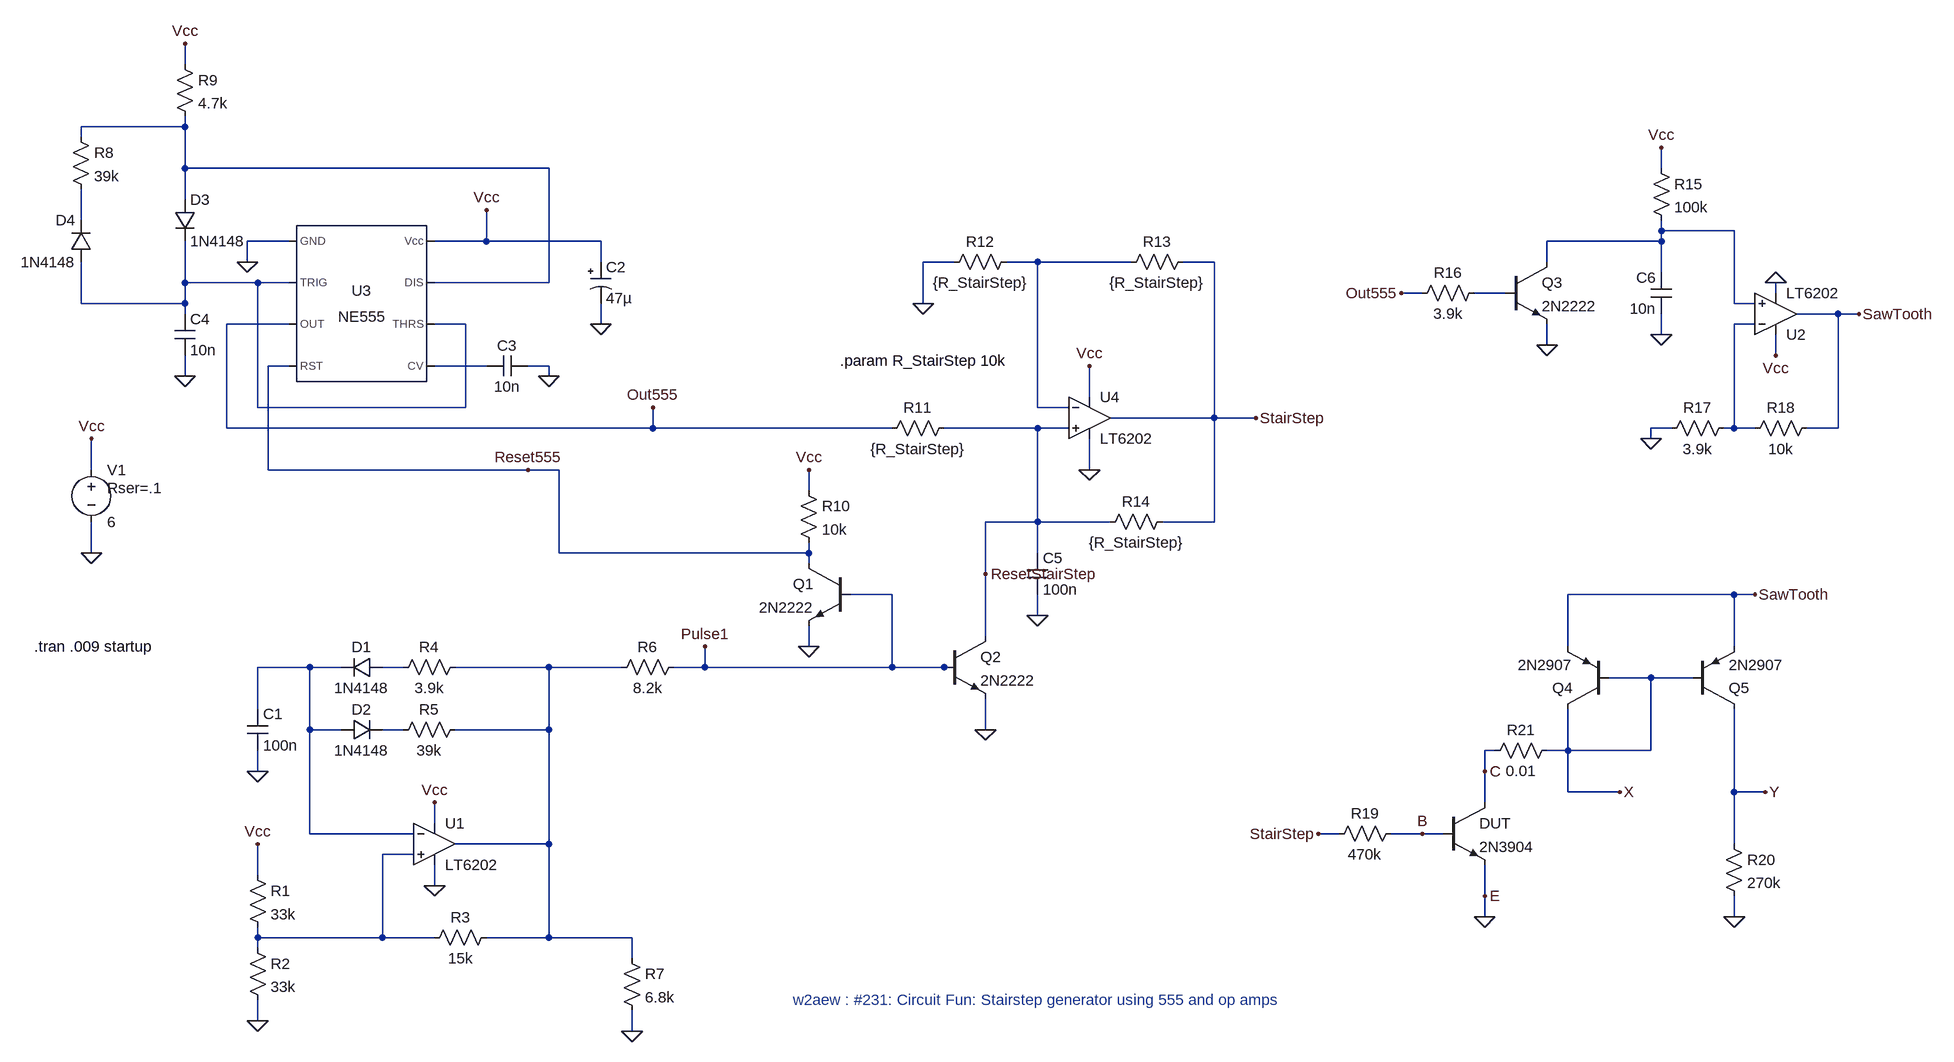
[diagram p0: schematic w2aew_CurveTracer1.asc]
w2aew_CurveTracer1.asc, the LTspice schematic file:
Version 4.1
SHEET 1 2508 1316
WIRE -1264 -848 -1264 -880
WIRE -1264 -752 -1264 -768
WIRE -1264 -752 -1424 -752
WIRE -1424 -736 -1424 -752
WIRE -1264 -688 -1264 -752
WIRE -704 -688 -1264 -688
WIRE 1008 -688 1008 -720
WIRE -1264 -640 -1264 -688
WIRE -1424 -608 -1424 -656
WIRE 1008 -592 1008 -608
WIRE 1120 -592 1008 -592
WIRE -1104 -576 -1168 -576
WIRE -800 -576 -800 -624
WIRE -800 -576 -880 -576
WIRE -624 -576 -800 -576
WIRE 1008 -576 1008 -592
WIRE 1008 -576 832 -576
WIRE -1168 -544 -1168 -576
WIRE -624 -544 -624 -576
WIRE -80 -544 -128 -544
WIRE 48 -544 0 -544
WIRE 192 -544 48 -544
WIRE 320 -544 272 -544
WIRE 832 -544 832 -576
WIRE 1008 -528 1008 -576
WIRE -1264 -512 -1264 -576
WIRE -1152 -512 -1264 -512
WIRE -1104 -512 -1152 -512
WIRE -704 -512 -704 -688
WIRE -704 -512 -880 -512
WIRE 640 -496 608 -496
WIRE 768 -496 720 -496
WIRE 1184 -496 1184 -512
WIRE -1424 -480 -1424 -544
WIRE -1264 -480 -1264 -512
WIRE -1264 -480 -1424 -480
WIRE -128 -480 -128 -544
WIRE 1120 -480 1120 -592
WIRE 1152 -480 1120 -480
WIRE -1264 -464 -1264 -480
WIRE 1280 -464 1216 -464
WIRE 1312 -464 1280 -464
WIRE -1104 -448 -1200 -448
WIRE -832 -448 -880 -448
WIRE -624 -448 -624 -480
WIRE 1152 -448 1120 -448
WIRE 1008 -432 1008 -464
WIRE 832 -416 832 -448
WIRE 1184 -400 1184 -432
WIRE -1104 -384 -1136 -384
WIRE -800 -384 -880 -384
WIRE -704 -384 -736 -384
WIRE -1264 -368 -1264 -400
WIRE -704 -368 -704 -384
WIRE 128 -336 128 -384
WIRE -1152 -320 -1152 -512
WIRE -832 -320 -832 -448
WIRE -832 -320 -1152 -320
WIRE 48 -320 48 -544
WIRE 96 -320 48 -320
WIRE 320 -304 320 -544
WIRE 320 -304 160 -304
WIRE 384 -304 320 -304
WIRE -1200 -288 -1200 -448
WIRE -544 -288 -544 -320
WIRE -544 -288 -1200 -288
WIRE -176 -288 -544 -288
WIRE 48 -288 -96 -288
WIRE 96 -288 48 -288
WIRE 1024 -288 992 -288
WIRE 1120 -288 1120 -448
WIRE 1120 -288 1104 -288
WIRE 1152 -288 1120 -288
WIRE 1280 -288 1280 -464
WIRE 1280 -288 1232 -288
WIRE 992 -272 992 -288
WIRE -1408 -224 -1408 -272
WIRE -1136 -224 -1136 -384
WIRE -736 -224 -1136 -224
WIRE -688 -224 -736 -224
WIRE 128 -224 128 -272
WIRE -304 -192 -304 -224
WIRE 48 -144 48 -288
WIRE 48 -144 -32 -144
WIRE 160 -144 48 -144
WIRE 320 -144 320 -304
WIRE 320 -144 240 -144
WIRE -1408 -96 -1408 -144
WIRE -688 -96 -688 -224
WIRE -304 -96 -304 -112
WIRE -304 -96 -688 -96
WIRE 48 -96 48 -144
WIRE -304 -80 -304 -96
WIRE -32 -64 -32 -144
WIRE -176 -32 -240 -32
WIRE 1120 -32 864 -32
WIRE 1152 -32 1120 -32
WIRE 48 0 48 -32
WIRE -32 32 -32 -64
WIRE -304 48 -304 16
WIRE 864 48 864 -32
WIRE 1120 48 1120 -32
WIRE -1072 80 -1152 80
WIRE -1024 80 -1072 80
WIRE -928 80 -960 80
WIRE -704 80 -848 80
WIRE -592 80 -704 80
WIRE -464 80 -464 48
WIRE -464 80 -512 80
WIRE -176 80 -176 -32
WIRE -176 80 -464 80
WIRE -96 80 -176 80
WIRE -80 80 -96 80
WIRE 992 96 928 96
WIRE 1056 96 992 96
WIRE -1152 144 -1152 80
WIRE -1072 176 -1072 80
WIRE -1024 176 -1072 176
WIRE -928 176 -960 176
WIRE -704 176 -704 80
WIRE -704 176 -848 176
WIRE -32 176 -32 128
WIRE 752 208 736 208
WIRE 864 208 864 144
WIRE 864 208 832 208
WIRE 992 208 992 96
WIRE 992 208 864 208
WIRE -1152 240 -1152 208
WIRE 736 240 736 208
WIRE 864 272 864 208
WIRE 944 272 864 272
WIRE 1120 272 1120 144
WIRE 1168 272 1120 272
WIRE 736 288 736 240
WIRE -880 320 -880 288
WIRE -1072 336 -1072 176
WIRE -912 336 -1072 336
WIRE 512 336 480 336
WIRE 640 336 592 336
WIRE 672 336 640 336
WIRE -704 352 -704 176
WIRE -704 352 -848 352
WIRE 1120 352 1120 272
WIRE -912 368 -960 368
WIRE -1152 400 -1152 352
WIRE -880 416 -880 384
WIRE 736 432 736 384
WIRE 736 464 736 432
WIRE 1120 464 1120 432
WIRE -1152 496 -1152 480
WIRE -960 496 -960 368
WIRE -960 496 -1152 496
WIRE -880 496 -960 496
WIRE -704 496 -704 352
WIRE -704 496 -800 496
WIRE -576 496 -704 496
WIRE -1152 512 -1152 496
WIRE -576 528 -576 496
WIRE -1152 624 -1152 592
WIRE -576 640 -576 608
FLAG -1408 -96 0
FLAG -1168 -544 0
FLAG -1408 -272 Vcc
FLAG -880 288 Vcc
FLAG 128 -384 Vcc
FLAG -800 -624 Vcc
FLAG -1152 352 Vcc
FLAG -576 640 0
FLAG -1152 624 0
FLAG -1152 240 0
FLAG -880 416 0
FLAG -464 48 Pulse1
FLAG 128 -224 0
FLAG -624 -448 0
FLAG -704 -368 0
FLAG -544 -320 Out555
FLAG -736 -224 Reset555
FLAG -1264 -368 0
FLAG -1264 -880 Vcc
FLAG -304 -224 Vcc
FLAG -304 48 0
FLAG -128 -480 0
FLAG 48 0 0
FLAG -32 176 0
FLAG 384 -304 StairStep
FLAG 1008 -432 0
FLAG 1184 -512 0
FLAG 832 -416 0
FLAG 736 464 0
FLAG 1120 464 0
FLAG 1008 -720 Vcc
FLAG 608 -496 Out555
FLAG 992 -272 0
FLAG 1184 -400 Vcc
FLAG 1312 -464 SawTooth
FLAG 944 272 X
FLAG 1168 272 Y
FLAG 480 336 StairStep
FLAG 1152 -32 SawTooth
FLAG 736 240 C
FLAG 640 336 B
FLAG 736 432 E
FLAG -32 -64 ResetStairStep
SYMBOL Misc\\NE555 -992 -480 R0
SYMATTR InstName U3
SYMBOL voltage -1408 -240 R0
WINDOW 123 0 0 Left 0
WINDOW 39 24 44 Left 2
SYMATTR SpiceLine Rser=.1
SYMATTR InstName V1
SYMATTR Value 6
SYMBOL res -1168 384 R0
SYMATTR InstName R1
SYMATTR Value 33k
SYMBOL res -1168 496 R0
SYMATTR InstName R2
SYMATTR Value 33k
SYMBOL res -784 480 R90
WINDOW 0 0 56 VBottom 2
WINDOW 3 32 56 VTop 2
SYMATTR InstName R3
SYMATTR Value 15k
SYMBOL res -832 64 R90
WINDOW 0 0 56 VBottom 2
WINDOW 3 32 56 VTop 2
SYMATTR InstName R4
SYMATTR Value 3.9k
SYMBOL res -832 160 R90
WINDOW 0 0 56 VBottom 2
WINDOW 3 32 56 VTop 2
SYMATTR InstName R5
SYMATTR Value 39k
SYMBOL res -496 64 R90
WINDOW 0 0 56 VBottom 2
WINDOW 3 32 56 VTop 2
SYMATTR InstName R6
SYMATTR Value 8.2k
SYMBOL cap -1168 144 R0
SYMATTR InstName C1
SYMATTR Value 100n
SYMBOL diode -960 64 R90
WINDOW 0 0 32 VBottom 2
WINDOW 3 32 32 VTop 2
SYMATTR InstName D1
SYMATTR Value 1N4148
SYMBOL diode -1024 192 R270
WINDOW 0 32 32 VTop 2
WINDOW 3 0 32 VBottom 2
SYMATTR InstName D2
SYMATTR Value 1N4148
SYMBOL res -592 512 R0
SYMATTR InstName R7
SYMATTR Value 6.8k
SYMBOL polcap -640 -544 R0
SYMATTR InstName C2
SYMATTR Value 47µ
SYMBOL cap -736 -400 R90
WINDOW 0 0 32 VBottom 2
WINDOW 3 32 32 VTop 2
SYMATTR InstName C3
SYMATTR Value 10n
SYMBOL diode -1280 -640 R0
SYMATTR InstName D3
SYMATTR Value 1N4148
SYMBOL diode -1408 -544 R180
WINDOW 0 24 64 Left 2
WINDOW 3 24 0 Left 2
SYMATTR InstName D4
SYMATTR Value 1N4148
SYMBOL res -1440 -752 R0
SYMATTR InstName R8
SYMATTR Value 39k
SYMBOL res -1280 -864 R0
SYMATTR InstName R9
SYMATTR Value 4.7k
SYMBOL cap -1280 -464 R0
SYMATTR InstName C4
SYMATTR Value 10n
SYMBOL npn -240 -80 M0
SYMATTR InstName Q1
SYMATTR Value 2N2222
SYMBOL res -320 -208 R0
SYMATTR InstName R10
SYMATTR Value 10k
SYMBOL npn -96 32 R0
SYMATTR InstName Q2
SYMATTR Value 2N2222
SYMBOL res -80 -304 R90
WINDOW 0 0 56 VBottom 2
WINDOW 3 32 56 VTop 2
SYMATTR InstName R11
SYMATTR Value {R_StairStep}
SYMBOL res 16 -560 R90
WINDOW 0 0 56 VBottom 2
WINDOW 3 32 56 VTop 2
SYMATTR InstName R12
SYMATTR Value {R_StairStep}
SYMBOL res 288 -560 R90
WINDOW 0 0 56 VBottom 2
WINDOW 3 32 56 VTop 2
SYMATTR InstName R13
SYMATTR Value {R_StairStep}
SYMBOL res 256 -160 R90
WINDOW 0 0 56 VBottom 2
WINDOW 3 32 56 VTop 2
SYMATTR InstName R14
SYMATTR Value {R_StairStep}
SYMBOL cap 32 -96 R0
SYMATTR InstName C5
SYMATTR Value 100n
SYMBOL OpAmps\\LT6202 128 -304 R0
SYMATTR InstName U4
SYMBOL OpAmps\\LT6202 -880 352 R0
SYMATTR InstName U1
SYMBOL npn 768 -544 R0
SYMATTR InstName Q3
SYMATTR Value 2N2222
SYMBOL OpAmps\\LT6202 1184 -464 M180
SYMATTR InstName U2
SYMBOL cap 1024 -464 R180
WINDOW 0 24 56 Left 2
WINDOW 3 24 8 Left 2
SYMATTR InstName C6
SYMATTR Value 10n
SYMBOL res 992 -704 R0
SYMATTR InstName R15
SYMATTR Value 100k
SYMBOL res 736 -512 R90
WINDOW 0 0 56 VBottom 2
WINDOW 3 32 56 VTop 2
SYMATTR InstName R16
SYMATTR Value 3.9k
SYMBOL res 1120 -304 R90
WINDOW 0 0 56 VBottom 2
WINDOW 3 32 56 VTop 2
SYMATTR InstName R17
SYMATTR Value 3.9k
SYMBOL res 1248 -304 R90
WINDOW 0 0 56 VBottom 2
WINDOW 3 32 56 VTop 2
SYMATTR InstName R18
SYMATTR Value 10k
SYMBOL res 608 320 R90
WINDOW 0 0 56 VBottom 2
WINDOW 3 32 56 VTop 2
SYMATTR InstName R19
SYMATTR Value 470k
SYMBOL pnp 928 144 R180
SYMATTR InstName Q4
SYMATTR Value 2N2907
SYMBOL pnp 1056 144 M180
SYMATTR InstName Q5
SYMATTR Value 2N2907
SYMBOL npn 672 288 R0
SYMATTR InstName DUT
SYMATTR Value 2N3904
SYMBOL res 1104 336 R0
SYMATTR InstName R20
SYMATTR Value 270k
SYMBOL res 848 192 R90
WINDOW 0 0 56 VBottom 2
WINDOW 3 32 56 VTop 2
SYMATTR InstName R21
SYMATTR Value 0.01
TEXT -1496 48 Left 2 !.tran .009 startup
TEXT -328 592 Left 2 ;w2aew : #231: Circuit Fun: Stairstep generator using 555 and op amps
TEXT -256 -392 Left 2 !.param R_StairStep 10k

The netlist it stands for:
* w2aew_CurveTracer1.asc
X§U3 0 N005 Out555 Reset555 N008 N005 N001 Vcc NE555  ; pins GND TRIG OUT RST CV THRS DIS Vcc
V1 Vcc 0 6 Rser=.1
R1 Vcc N013 33k
R2 N013 0 33k
R3 N011 N013 15k
R4 N011 N010 3.9k
R5 N011 N012 39k
R6 Pulse1 N011 8.2k
C1 N009 0 100n
D1 N010 N009 1N4148
D2 N009 N012 1N4148
R7 N011 0 6.8k
C2 Vcc 0 47µ
C3 0 N008 10n
D3 N001 N005 1N4148
D4 N005 N002 1N4148
R8 N001 N002 39k
R9 Vcc N001 4.7k
C4 N005 0 10n
Q1 Reset555 Pulse1 0 0 2N2222
R10 Vcc Reset555 10k
Q2 ResetStairStep Pulse1 0 0 2N2222
R11 ResetStairStep Out555 {R_StairStep}
R12 N004 0 {R_StairStep}
R13 StairStep N004 {R_StairStep}
R14 StairStep ResetStairStep {R_StairStep}
C5 ResetStairStep 0 100n
* U4: LT6202 (symbol OpAmps\LT6202 not available, pins judged from their places): In+=ResetStairStep In-=N004 V+=Vcc V-=0 OUT=StairStep
* U1: LT6202 (symbol OpAmps\LT6202 not available, pins judged from their places): In+=N013 In-=N009 V+=Vcc V-=0 OUT=N011
Q3 N003 N006 0 0 2N2222
* U2: LT6202 (symbol OpAmps\LT6202 not available, pins judged from their places): In+=N003 In-=N007 V+=Vcc V-=0 OUT=SawTooth
C6 0 N003 10n
R15 Vcc N003 100k
R16 N006 Out555 3.9k
R17 N007 0 3.9k
R18 SawTooth N007 10k
R19 B StairStep 470k
Q4 X X SawTooth 0 2N2907
Q5 Y X SawTooth 0 2N2907
Q§DUT C B 0 0 2N3904
R20 Y 0 270k
R21 X C 0.01
.model D D
.lib standard.dio
.model NPN NPN
.model PNP PNP
.lib standard.bjt
.tran .009 startup
* w2aew : #231: Circuit Fun: Stairstep generator using 555 and op amps
.param R_StairStep 10k
.lib NE555.sub
.backanno
.end